# Altium project Headphone Amp.PrjPcb
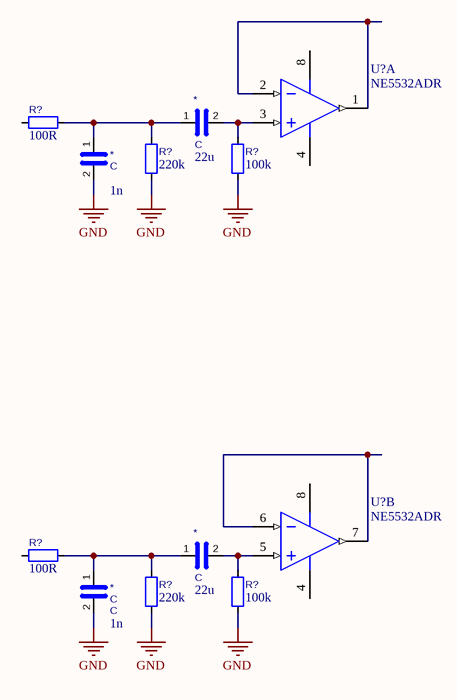
[diagram p0: PCM290x.SchDoc]
3 sheets, 50 parts. Net scope: flat (ports and power ports of the same name join across sheets).
Sheets:
  PowerSupply.SchDoc
  PCM290x.SchDoc
  VolumeControl.SchDoc

## Sheet PowerSupply.SchDoc
size A4; SheetNumber: 1; SheetTotal: 1

## Sheet PCM290x.SchDoc
size A4; SheetNumber: 2; SheetTotal: 3

### Parts
(Parts that share a designator on the sheet are numbered #1, #2 ... from top to bottom, then left to right.)
*#1  22u
*#2  1n
*#3  22u
*#4  1n  value C
R?#1  100R
R?#2  220k
R?#3  100k
R?#4  100R
R?#5  220k
R?#6  100k
U?#1  NE5532ADR  [D0008A_M]  (part A of 2)
U?#2  NE5532ADR  [D0008A_M]  (part B of 2)

### Nets
GND: *#2.2 *#4.2 R?#2.2 R?#3.2 R?#5.2 R?#6.2
Net*#1_1: *#1.1 *#2.1 R?#1.2 R?#2.1
Net*#1_2: *#1.2 R?#3.1 U?#1.3(IN1+)
Net*#3_1: *#3.1 *#4.1 R?#4.2 R?#5.1
Net*#3_2: *#3.2 R?#6.1 U?#2.5(IN2+)
NetU?#1_1: U?#1.1(OUT1) U?#1.2(IN1-)
NetU?#2_6: U?#2.6(IN2-) U?#2.7(OUT2)

Not connected (* = marked no-connect by the designer): R?#1 1; R?#4 1; U?#1 4(VCC-) 8(VCC+); U?#2 4(VCC-) 8(VCC+)

### Library data of the parts
*#1-*#4 = C: Unpolarized capacitor; ki_keywords: cap capacitor; ki_fp_filters: C_*; Reference: C; Datasheet: ~; Description_: Unpolarized capacitor
  *#1 *#3: 22u: C
  *#2: 1n: C
R?#1-R?#6 = R: Resistor
U?#1 U?#2 = CMP-0017-00450-2: Dual Low-Noise Operational Amplifier, 10 to 30 V, 0 to 70 degC, 8-pin SOIC (D8), Green (RoHS & no Sb/Br); Manufacturer: Texas Instruments; Total Supply Voltage(Min)(+5V is 5, +/-5V is 10): 10; Slew Rate(Typ)(V/us): 9; Sub Family: General Purpose Amplifier, High Supply Voltage Amplifier (>=30V), Low Noise Amp (<=10nV/rtHz); Vio (25C)(Max)(mV): 4; IIB(Max)(pA): 800000; Vn at 1kHz(Typ)(nV/rtHz): 5; Number of Channels: 2; Total Supply Voltage(Max)(+5V is 5, +/-5V is 10): 30; CMRR(Min)(dB): 70; Code_JEDEC: MS-012; ComponentLink1URL: http://www.ti.com/; DatasheetVersion: SLOS075I; PackageDescription: 8-Pin Plastic Small Outline, Body 4.9 x 3.9 mm, Pitch 1.27 mm; Eco-Plan: Green (RoHS & no Sb/Br); ComponentLink3Description: Package Specification; PackageReference: D0008A; Mounting Technology: Surface Mount; GBW(Typ)(MHz): 10; ComponentLink2Description: Datasheet; ComponentLink1Description: Manufacturer URL; PartNumber: NE5532ADR; ComponentLink3URL: http://www.ti.com/litv/pdf/msoi002j; PackageVersion: 4040047-3/M, 06/2011; ComponentLink2URL: http://www.ti.com/lit/ds/symlink/ne5532a.pdf; Iq per channel(Max)(mA): 4

## Sheet VolumeControl.SchDoc
size A4; SheetNumber: 3; SheetTotal: 3
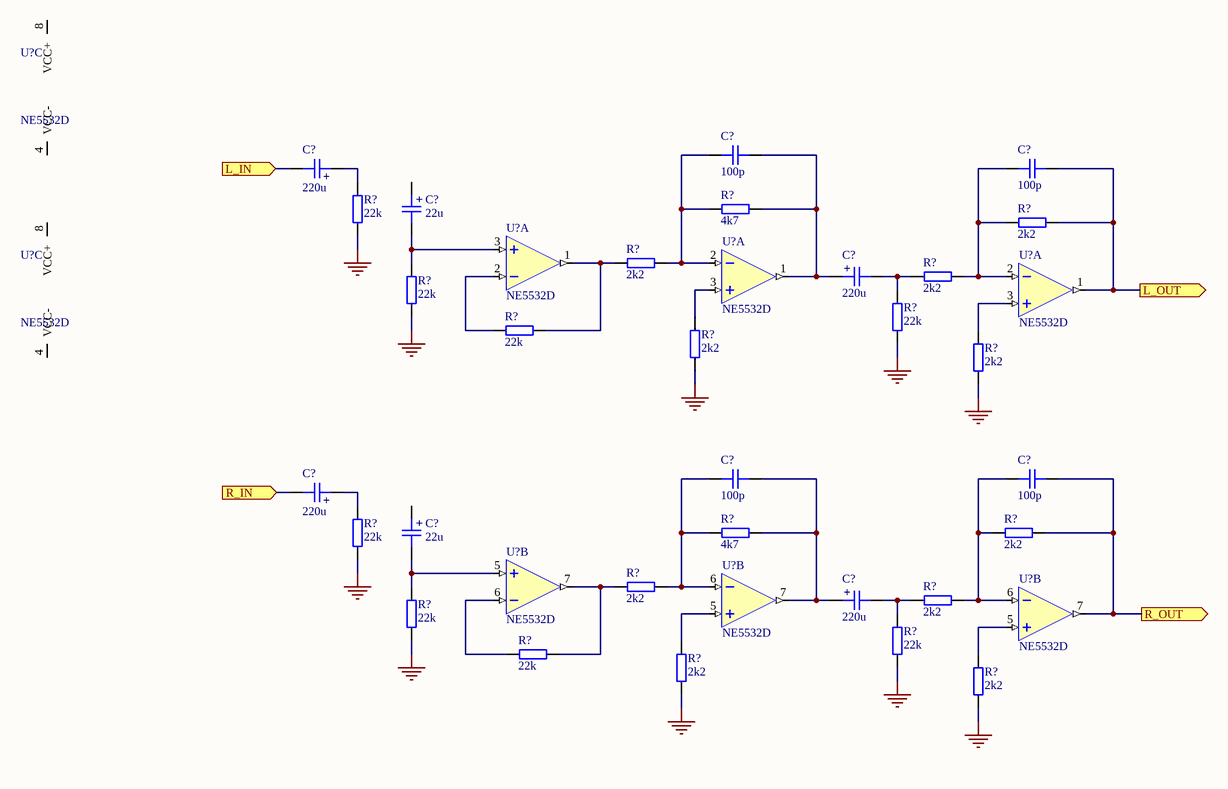
[diagram p1: VolumeControl.SchDoc]

### Parts
(Parts that share a designator on the sheet are numbered #1, #2 ... from top to bottom, then left to right.)
C?#1  100p  [CAP_0603]
C?#2  220u  [CAP_AE_SMD_D6MM3_H5M55]
C?#3  100p  [CAP_0603]
C?#4  22u  [CAP_AE_SMD_D6MM3_H5M55]
C?#5  220u  [CAP_AE_SMD_D6MM3_H5M55]
C?#6  100p  [CAP_0603]
C?#7  100p  [CAP_0603]
C?#8  220u  [CAP_AE_SMD_D6MM3_H5M55]
C?#9  22u  [CAP_AE_SMD_D6MM3_H5M55]
C?#10  220u  [CAP_AE_SMD_D6MM3_H5M55]
R?#7  22k  [RES_0603]
R?#8  4k7  [RES_0603]
R?#9  2k2  [RES_0603]
R?#10  2k2  [RES_0603]
R?#11  2k2  [RES_0603]
R?#12  22k  [RES_0603]
R?#13  22k  [RES_0603]
R?#14  22k  [RES_0603]
R?#15  2k2  [RES_0603]
R?#16  2k2  [RES_0603]
R?#17  22k  [RES_0603]
R?#18  4k7  [RES_0603]
R?#19  2k2  [RES_0603]
R?#20  2k2  [RES_0603]
R?#21  2k2  [RES_0603]
R?#22  22k  [RES_0603]
R?#23  22k  [RES_0603]
R?#24  22k  [RES_0603]
R?#25  2k2  [RES_0603]
R?#26  2k2  [RES_0603]
U?#3  NE5532D  [SOIC-8]  (part C of 3)
U?#4  NE5532D  [SOIC-8]  (part A of 3)
U?#5  NE5532D  [SOIC-8]  (part A of 3)
U?#6  NE5532D  [SOIC-8]  (part C of 3)
U?#7  NE5532D  [SOIC-8]  (part A of 3)
U?#8  NE5532D  [SOIC-8]  (part B of 3)
U?#9  NE5532D  [SOIC-8]  (part B of 3)
U?#10  NE5532D  [SOIC-8]  (part B of 3)

### Ports
L_IN (in), L_OUT (out), R_IN (in), R_OUT (out)

### Nets
GND: R?#7.1 R?#12.1 R?#13.1 R?#15.1 R?#16.2 R?#17.1 R?#22.1 R?#23.1 R?#25.1 R?#26.1
NetC?#1_1: C?#1.1 R?#8.1 R?#10.1 U?#5.2(1IN-)
NetC?#1_2: C?#1.2 C?#5.1 R?#8.2 U?#5.1(1OUT)
NetC?#2_1: C?#2.1 R?#7.2
NetC?#2_2: C?#2.2 ; port L_IN
NetC?#3_1: C?#3.1 R?#9.2 R?#11.1 U?#7.2(1IN-)
NetC?#3_2: C?#3.2 R?#9.1 U?#7.1(1OUT) ; port L_OUT
NetC?#4_2: C?#4.2 R?#12.2 U?#4.3(1IN+)
NetC?#5_2: C?#5.2 R?#11.2 R?#13.2
NetC?#6_1: C?#6.1 R?#18.1 R?#20.1 U?#9.6(2IN-)
NetC?#6_2: C?#6.2 C?#10.1 R?#18.2 U?#9.7(2OUT)
NetC?#7_1: C?#7.1 R?#19.2 R?#21.1 U?#10.6(2IN-)
NetC?#7_2: C?#7.2 R?#19.1 U?#10.7(2OUT) ; port R_OUT
NetC?#8_1: C?#8.1 R?#17.2
NetC?#8_2: C?#8.2 ; port R_IN
NetC?#9_2: C?#9.2 R?#22.2 U?#8.5(2IN+)
NetC?#10_2: C?#10.2 R?#21.2 R?#23.2
NetR?#10_2: R?#10.2 R?#14.1 U?#4.1(1OUT)
NetR?#14_2: R?#14.2 U?#4.2(1IN-)
NetR?#15_2: R?#15.2 U?#5.3(1IN+)
NetR?#16_1: R?#16.1 U?#7.3(1IN+)
NetR?#20_2: R?#20.2 R?#24.1 U?#8.7(2OUT)
NetR?#24_2: R?#24.2 U?#8.6(2IN-)
NetR?#25_2: R?#25.2 U?#9.5(2IN+)
NetR?#26_2: R?#26.2 U?#10.5(2IN+)

Not connected (* = marked no-connect by the designer): C?#4 1; C?#9 1; U?#3 4(VCC-) 8(VCC+); U?#6 4(VCC-) 8(VCC+)

### Notes on the sheet
- (in symbol CAP_ALEL_6.3x5.5) +

### Library data of the parts
C?#1 C?#3 C?#6 C?#7 = CAP_0603: Capacitor SMD 0603; Manufacturer: *; Manufacturer Part Number: *; Distributor Link: *; LCSC: *; Rating: *; Dielectric: *
C?#2 C?#4 C?#5 C?#8-C?#10 = CAP_ALEL_6.3x5.5: Capacitor SMD Aluminium Electrolytic 6.3mm Diameter 5.5mm Height; Manufacturer: *; Manufacturer Part Number: *; Distributor Link: *; LCSC: *
R?#7-R?#26 = RES_0603: Resistor SMD 0603; Manufacturer: *; Manufacturer Part Number: *; Distributor Link: *; LCSC: *
U?#3-U?#10 = NE5532D: Dual Low-Noise Operational Amplifiers; Manufacturer: Texas Instruments; Manufacturer Part Number: NE5532D

## Nets that join several sheets
GND: PCM290x (6 pins), VolumeControl (10 pins)